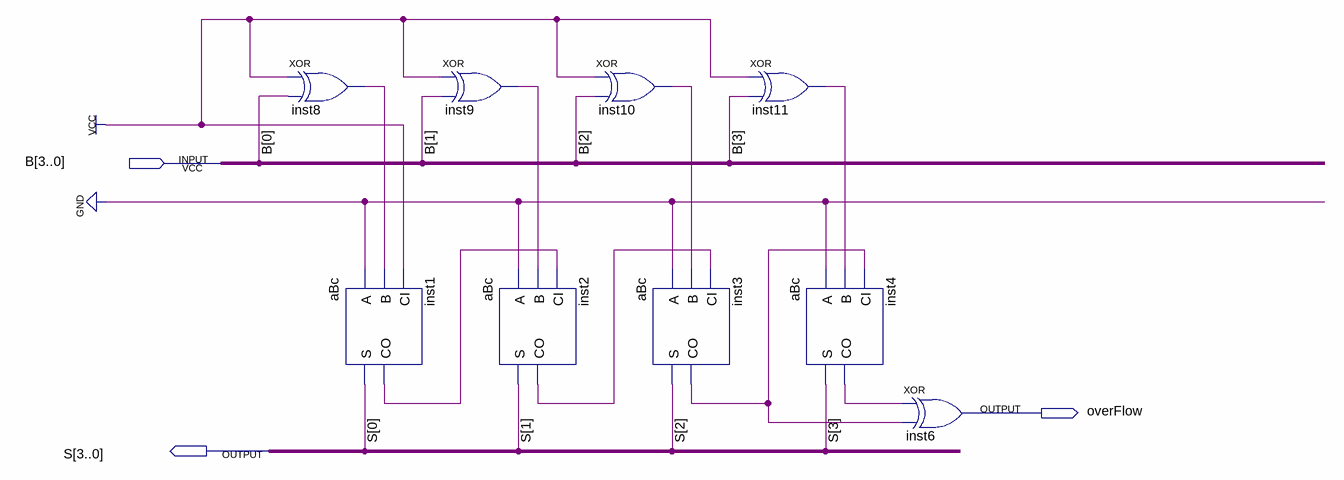
[diagram p0: schematic sheet]
// Quartus schematic complemento2.bdf as structural Verilog: 9 symbols, 3 pins
module complemento2 (
  input  [3:0] B,
  output overFlow,
  output [3:0] S
);

  wire inst1_co, inst2_co, inst3_co, inst4_co, inst8_out, inst9_out, inst10_out, inst11_out;

  xor inst8 (inst8_out, 1'b1, B[0]);
  aBc inst1 (.A(1'b0), .B(inst8_out), .CI(1'b1), .S(S[0]), .CO(inst1_co));
  xor inst9 (inst9_out, 1'b1, B[1]);
  aBc inst2 (.A(1'b0), .B(inst9_out), .CI(inst1_co), .S(S[1]), .CO(inst2_co));
  xor inst10 (inst10_out, 1'b1, B[2]);
  aBc inst3 (.A(1'b0), .B(inst10_out), .CI(inst2_co), .S(S[2]), .CO(inst3_co));
  xor inst11 (inst11_out, 1'b1, B[3]);
  aBc inst4 (.A(1'b0), .B(inst11_out), .CI(inst3_co), .S(S[3]), .CO(inst4_co));
  xor inst6 (overFlow, inst4_co, inst3_co);
endmodule
